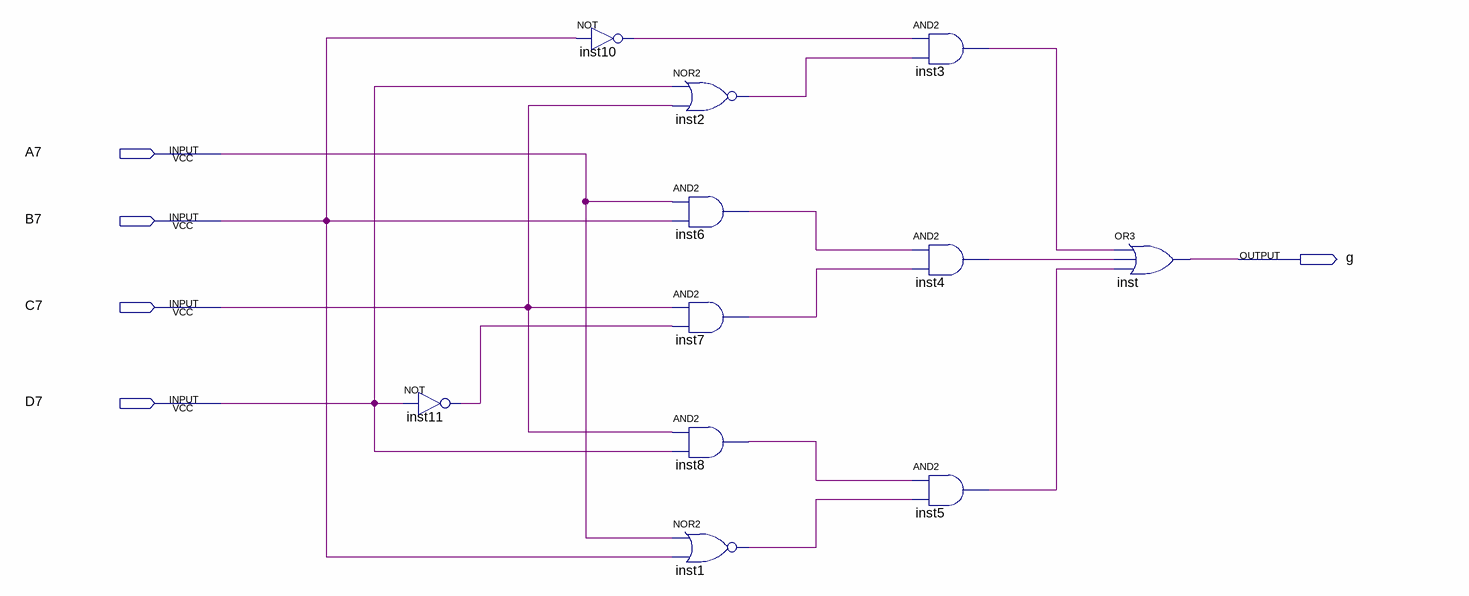
[diagram p0: schematic sheet]
// Quartus schematic Segment_g.bdf as structural Verilog: 11 symbols, 5 pins
module Segment_g (
  input  A7,
  input  B7,
  input  C7,
  input  D7,
  output g
);

  wire inst1_out, inst2_out, inst3_out, inst4_out, inst5_out, inst6_out, inst7_out, inst8_out, inst10_out,
       inst11_out;

  not inst11 (inst11_out, D7);
  not inst10 (inst10_out, B7);
  nor inst2 (inst2_out, D7, C7);
  and inst6 (inst6_out, A7, B7);
  and inst7 (inst7_out, C7, inst11_out);
  and inst8 (inst8_out, C7, D7);
  nor inst1 (inst1_out, A7, B7);
  and inst3 (inst3_out, inst10_out, inst2_out);
  and inst4 (inst4_out, inst6_out, inst7_out);
  and inst5 (inst5_out, inst8_out, inst1_out);
  or inst (g, inst3_out, inst4_out, inst5_out);
endmodule
